# EAGLE schematic esquematico (EAGLE 9.6.2)
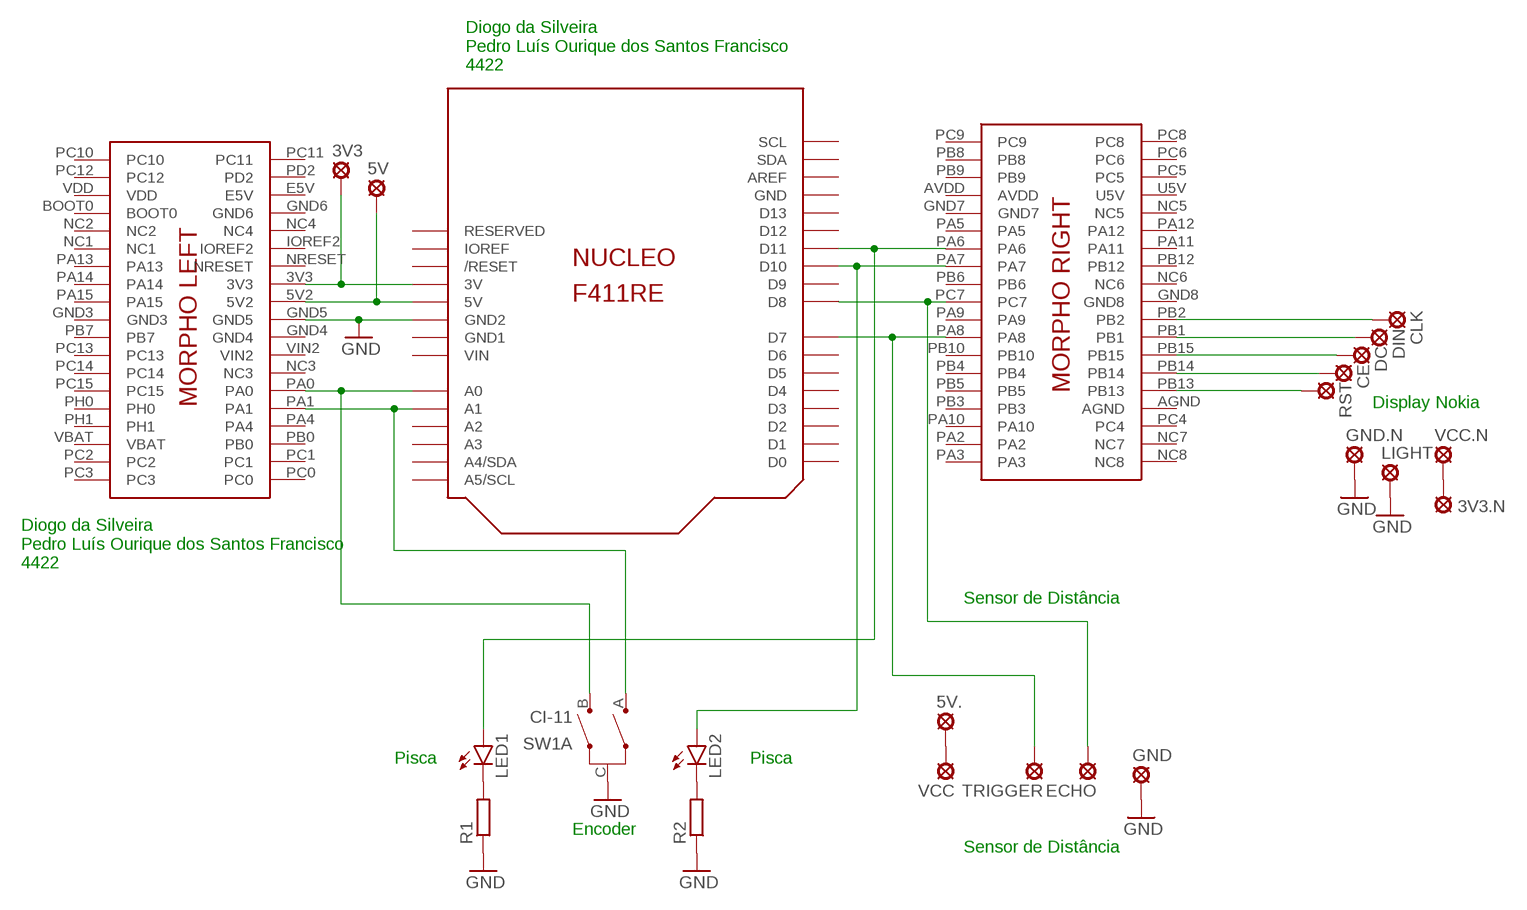
[diagram p0: schematic, sheet 1]

## Parts
3V3  SE11  [SE11]
3V3.N  SE11  [SE11]
5V  SE11  [SE11]
5V.  SE11  [SE11]
CE  SE11  [SE11]
CLK  SE11  [SE11]
DC  SE11  [SE11]
DIN  SE11  [SE11]
ECHO  SE11  [SE11]
GND  SE11  [SE11]
GND.N  SE11  [SE11]
LED1  LED3MM  [LED3MM]
LED2  LED3MM  [LED3MM]
LIGHT  SE11  [SE11]
R1  R-EU_0204/7  [0204/7]
R2  R-EU_0204/7  [0204/7]
RST  SE11  [SE11]
SW1  CI-11  [CI-11]
TRIGGER  SE11  [SE11]
U$1  NUCLEO_F411RE  [NUCLEO_BRD64]
VCC  SE11  [SE11]
VCC.N  SE11  [SE11]

## Nets
GND: GND.MP GND.N.MP LIGHT.MP R1.1 R2.1 SW1.C(A:C) U$1.GND2 U$1.GND5
N$1: 3V3.MP U$1.3V U$1.3V3
N$2: 5V.MP U$1.5V U$1.5V2
N$3: 5V..MP VCC.MP
N$4: LED1.K(C) R1.2
N$5: LED2.K(C) R2.2
N$6: CLK.MP U$1.PB2
N$7: DIN.MP U$1.PB1
N$8: DC.MP U$1.PB15
N$9: CE.MP U$1.PB14
N$10: RST.MP U$1.PB13
N$11: 3V3.N.MP VCC.N.MP
N$12: TRIGGER.MP U$1.D7 U$1.PA8
N$13: ECHO.MP U$1.D8 U$1.PC7
N$15: SW1.B(A:B) U$1.A0 U$1.PA0
N$16: SW1.A(A:A) U$1.A1 U$1.PA1
N$17: LED2.A U$1.D10 U$1.PA7
N$18: LED1.A U$1.D11 U$1.PA6
Unconnected: SW1.D(B:D) SW1.E(B:E) U$1.A2 U$1.A3 U$1.A4(A4/SDA) U$1.A5(A5/SCL) U$1.AREF U$1.BOOT0 U$1.D0 U$1.D1 U$1.D2 U$1.D3 U$1.D4 U$1.D5 U$1.D6 U$1.D9 U$1.D12 U$1.D13 U$1.IOREF U$1.IOREF2 U$1.NC1 U$1.NC2 U$1.NC3 U$1.NC4 U$1.NC5 U$1.NC6 U$1.NC7 U$1.NC8 U$1.NRESET U$1.PA2 U$1.PA3 U$1.PA4 U$1.PA5 U$1.PA9 U$1.PA10 U$1.PA11 U$1.PA12 U$1.PA13 U$1.PA14 U$1.PA15 U$1.PB0 U$1.PB3 U$1.PB4 U$1.PB5 U$1.PB6 U$1.PB7 U$1.PB8 U$1.PB9 U$1.PB10 U$1.PB12 U$1.PC0 U$1.PC1 U$1.PC2 U$1.PC3 U$1.PC4 U$1.PC5 U$1.PC6 U$1.PC8 U$1.PC9 U$1.PC10 U$1.PC11 U$1.PC12 U$1.PC13 U$1.PC14 U$1.PC15 U$1.PD2 U$1.PH0 U$1.PH1 U$1.RESERVED U$1.RESET(/RESET) U$1.SCL U$1.SDA

## Notes on the sheet
- Diogo da Silveira
  Pedro Luís Ourique dos Santos Francisco
  4422
- Display Nokia
- Diogo da Silveira
  Pedro Luís Ourique dos Santos Francisco
  4422
- Sensor de Distância
- Pisca | Pisca
- Encoder
- Sensor de Distância

## Power pins joined to a net without a drawn wire
AGND: U$1.AGND
AVDD: U$1.AVDD
E5V: U$1.E5V
GND: U$1.GND
GND1: U$1.GND1
GND3: U$1.GND3
GND4: U$1.GND4
GND6: U$1.GND6
GND7: U$1.GND7
GND8: U$1.GND8
U5V: U$1.U5V
VBAT: U$1.VBAT
VDD: U$1.VDD
VIN: U$1.VIN
VIN2: U$1.VIN2

## Library data of the parts
3V3 3V3.N 5V 5V. CE CLK DC DIN ECHO GND GND.N LIGHT RST TRIGGER VCC VCC.N = solpad:SE11: SOLDER PAD RTM, drill 1,1mm, distributor Buerklin, 07F810
LED1 LED2 = led:LED: LED OSRAM: - CHIPLED LG R971, LG N971, LY N971, LG Q971, LY Q971, LO R971, LY R971 LH N974, LH R974 LS Q976, LO Q976, LY Q976 LO Q996 - Hyper CHIPLED LW Q18S LB Q993, LB Q99A, LB R99A - SideLED LS A670, LO A670, LY A670, LG A670, LP A670 LB A673, LV A673, LT A673, LW A673 LH A674 LY A675 LS A676, LA A676, LO A676, LY A676, LW A676 LS A679, LY A679, LG A679 - Hyper Micro SIDELED® LS Y876, LA Y876, LO Y876, LY Y876 LT Y87S - SmartLED LW L88C, LW L88S LB L89C, LB L89S, LG L890 LS L89K, LO L89K, LY L89K LS L896, LA L896, LO L896, LY L896 - TOPLED LS T670, LO T670, LY T670, LG T670, LP T670 LSG T670, LSP T670, LSY T670, LOP T670, LYG T670 LG T671, LOG T671, LSG T671 LB T673, LV T673, LT T673, LW T673 LH T674 LS T676, LA T676, LO T676, LY T676, LB T676, LH T676, LSB T676, LW T676 LB T67C, LV T67C, LT T67C, LS T67K, LO T67K, LY T67K, LW E67C LS E67B, LA E67B, LO E67B, LY E67B, LB E67C, LV E67C, LT E67C LW T67C LS T679, LY T679, LG T679 LS T770, LO T770, LY T770, LG T770, LP T770 LB T773, LV T773, LT T773, LW T773 LH T774 LS E675, LA E675, LY E675, LS T675 LS T776, LA T776, LO T776, LY T776, LB T776 LHGB T686 LT T68C, LB T68C - Hyper Mini TOPLED® LB M676 - Mini TOPLED Santana® LG M470 LS M47K, LO M47K, LY M47K Source: http://www.osram.convergy.de LUXEON: - LUMILED® LXK2-PW12-R00, LXK2-PW12-S00, LXK2-PW14-U00, LXK2-PW14-V00 LXK2-PM12-R00, LXK2-PM12-S00, LXK2-PM14-U00 LXK2-PE12-Q00, LXK2-PE12-R00, LXK2-PE12-S00, LXK2-PE14-T00, LXK2-PE14-U00 LXK2-PB12-K00, LXK2-PB12-L00, LXK2-PB12-M00, LXK2-PB14-N00, LXK2-PB14-P00, LXK2-PB14-Q00 LXK2-PR12-L00, LXK2-PR12-M00, LXK2-PR14-Q00, LXK2-PR14-R00 LXK2-PD12-Q00, LXK2-PD12-R00, LXK2-PD12-S00 LXK2-PH12-R00, LXK2-PH12-S00 LXK2-PL12-P00, LXK2-PL12-Q00, LXK2-PL12-R00 Source: www.luxeon.com KINGBRIGHT: KA-3528ASYC Source: www.kingbright.com
R1 R2 = rcl:R-EU_: RESISTOR, European symbol; SPICEPREFIX: R
SW1 = piher:CI-11: 11mm Incemental Encoder Source: www.piher.net .. 04-CI-11v04.pdf; OC_FARNELL: unknown; OC_NEWARK: unknown
U$1 = Stm32nucleo (1):NUCLEO_F411RE